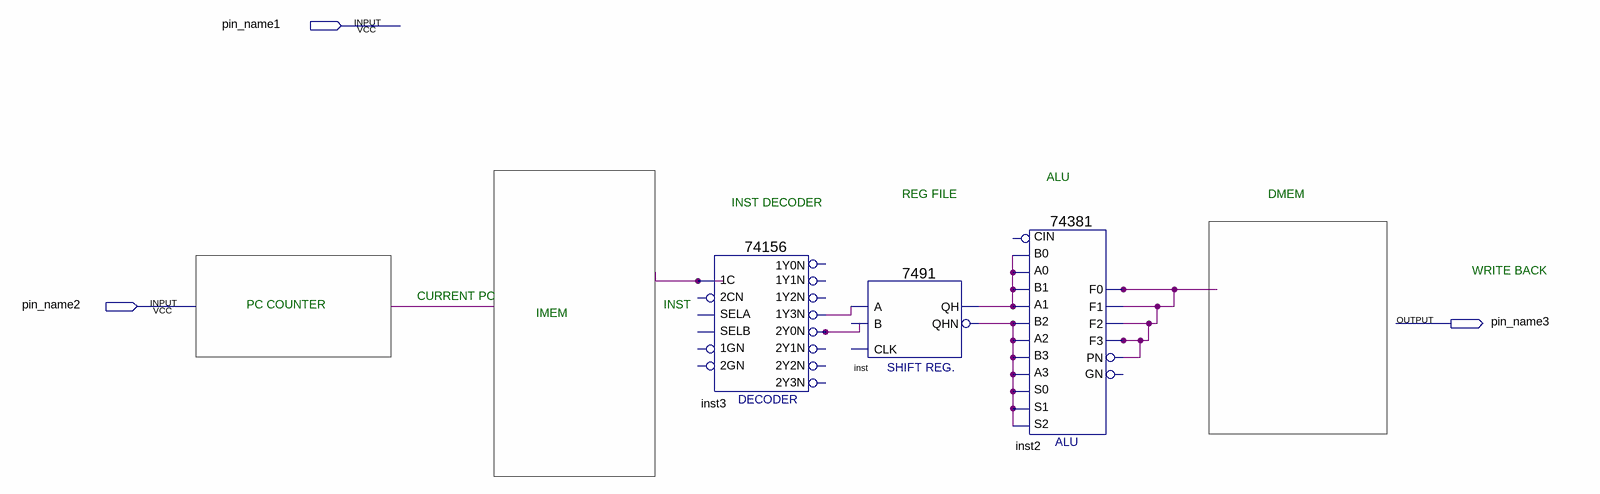
[diagram p0: schematic sheet]
// Quartus schematic Block1.bdf as structural Verilog: 3 symbols, 3 pins
module Block1 (
  input  pin_name1,
  input  pin_name2,
  output pin_name3
);

  wire inst2_f0, inst3_1y3n, inst3_2y0n, inst_qh, inst_qhn, undriven;

  \74156  inst3 (
    .\1C (undriven), .\1Y3N (inst3_1y3n), .\2Y0N (inst3_2y0n));  // open: SELA, 2CN, 2GN, 1GN, SELB, 1Y0N, 1Y2N, 1Y1N, 2Y3N, 2Y1N, 2Y2N
  \7491  inst (.A(inst3_1y3n), .QH(inst_qh), .QHN(inst_qhn));  // open: B, CLK
  \74381  inst2 (
    .A1(inst_qh), .B1(inst_qh), .A0(inst_qh), .B0(inst_qh), .A3(inst_qhn), .A2(inst_qhn), .B3(inst_qhn),
    .B2(inst_qhn), .S2(inst_qhn), .S1(inst_qhn), .S0(inst_qhn), .F0(inst2_f0), .F1(inst2_f0), .F3(inst2_f0),
    .F2(inst2_f0), .PN(inst2_f0));  // open: CIN, GN

  // Notes on the sheet:
  //   ALU
  //   REG FILE
  //   DMEM
  //   INST DECODER
  //   WRITE BACK
  //   CURRENT PC
  //   PC COUNTER
  //   INST
  //   IMEM
endmodule
